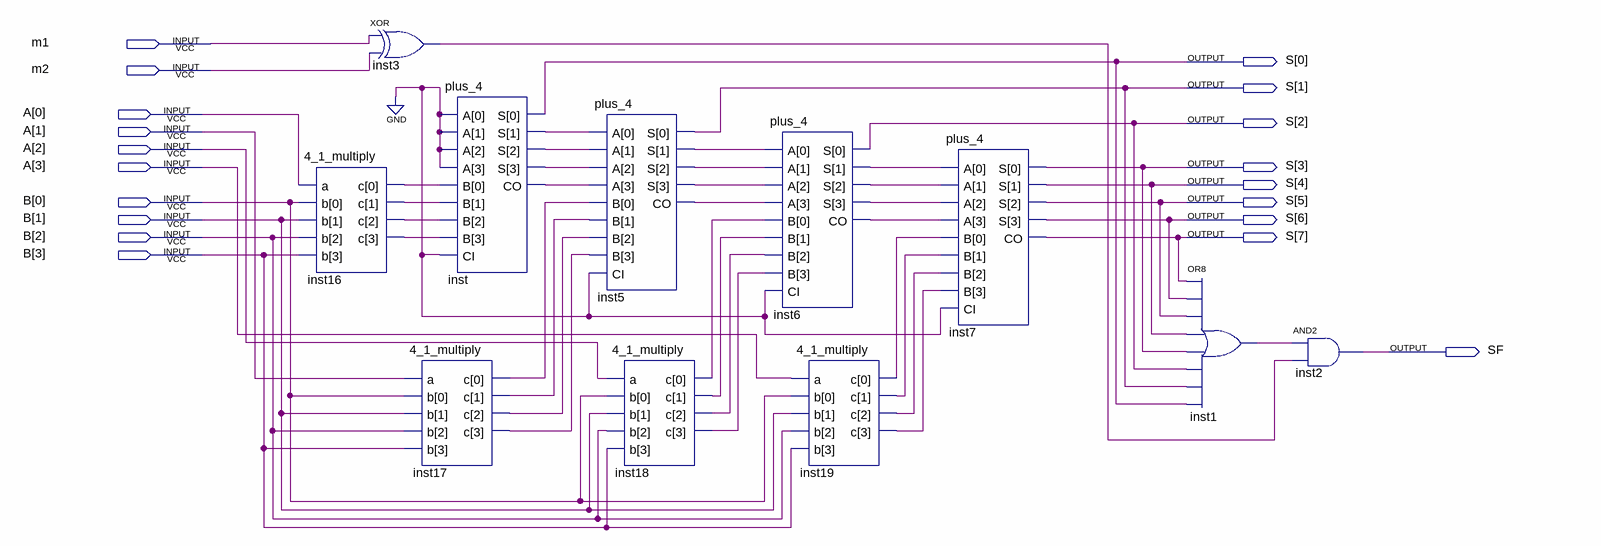
[diagram p0: schematic sheet]
// Quartus schematic nulti.bdf as structural Verilog: 11 symbols, 19 pins
module nulti (
  input  m1,
  input  m2,
  input  [3:0] A,
  input  [3:0] B,
  output [7:0] S,
  output SF
);

  wire inst1_out, inst3_out, inst5_co, inst5_s, inst5_s_2, inst5_s_3, inst6_co, inst6_s, inst6_s_2,
       inst6_s_3, inst16_c, inst16_c_2, inst16_c_3, inst16_c_4, inst17_c, inst17_c_2, inst17_c_3, inst17_c_4,
       inst18_c, inst18_c_2, inst18_c_3, inst18_c_4, inst19_c, inst19_c_2, inst19_c_3, inst19_c_4, inst_co,
       inst_s, inst_s_2, inst_s_3;

  \4_1_multiply  inst16 (.a(A[0]), .b(B), .c({inst16_c_4, inst16_c_3, inst16_c_2, inst16_c}));
  xor inst3 (inst3_out, m1, m2);
  plus_4 inst (
    .A(4'b0000), .B({inst16_c_4, inst16_c_3, inst16_c_2, inst16_c}), .CI(1'b0),
    .S({inst_s_3, inst_s_2, inst_s, S[0]}), .CO(inst_co));
  \4_1_multiply  inst17 (.a(A[1]), .b(B), .c({inst17_c_4, inst17_c_3, inst17_c_2, inst17_c}));
  plus_4 inst5 (
    .A({inst_co, inst_s_3, inst_s_2, inst_s}), .B({inst17_c_4, inst17_c_3, inst17_c_2, inst17_c}), .CI(1'b0),
    .S({inst5_s_3, inst5_s_2, inst5_s, S[1]}), .CO(inst5_co));
  \4_1_multiply  inst18 (.a(A[2]), .b(B), .c({inst18_c_4, inst18_c_3, inst18_c_2, inst18_c}));
  plus_4 inst6 (
    .A({inst5_co, inst5_s_3, inst5_s_2, inst5_s}), .B({inst18_c_4, inst18_c_3, inst18_c_2, inst18_c}),
    .CI(1'b0), .S({inst6_s_3, inst6_s_2, inst6_s, S[2]}), .CO(inst6_co));
  \4_1_multiply  inst19 (.a(A[3]), .b(B), .c({inst19_c_4, inst19_c_3, inst19_c_2, inst19_c}));
  plus_4 inst7 (
    .A({inst6_co, inst6_s_3, inst6_s_2, inst6_s}), .B({inst19_c_4, inst19_c_3, inst19_c_2, inst19_c}),
    .CI(1'b0), .S(S[6:3]), .CO(S[7]));
  or inst1 (inst1_out, S[7], S[6], S[5], S[4], S[3], S[2], S[1], S[0]);
  and inst2 (SF, inst1_out, inst3_out);
endmodule
